# EAGLE design WSS-Board (EAGLE 9.6.2)
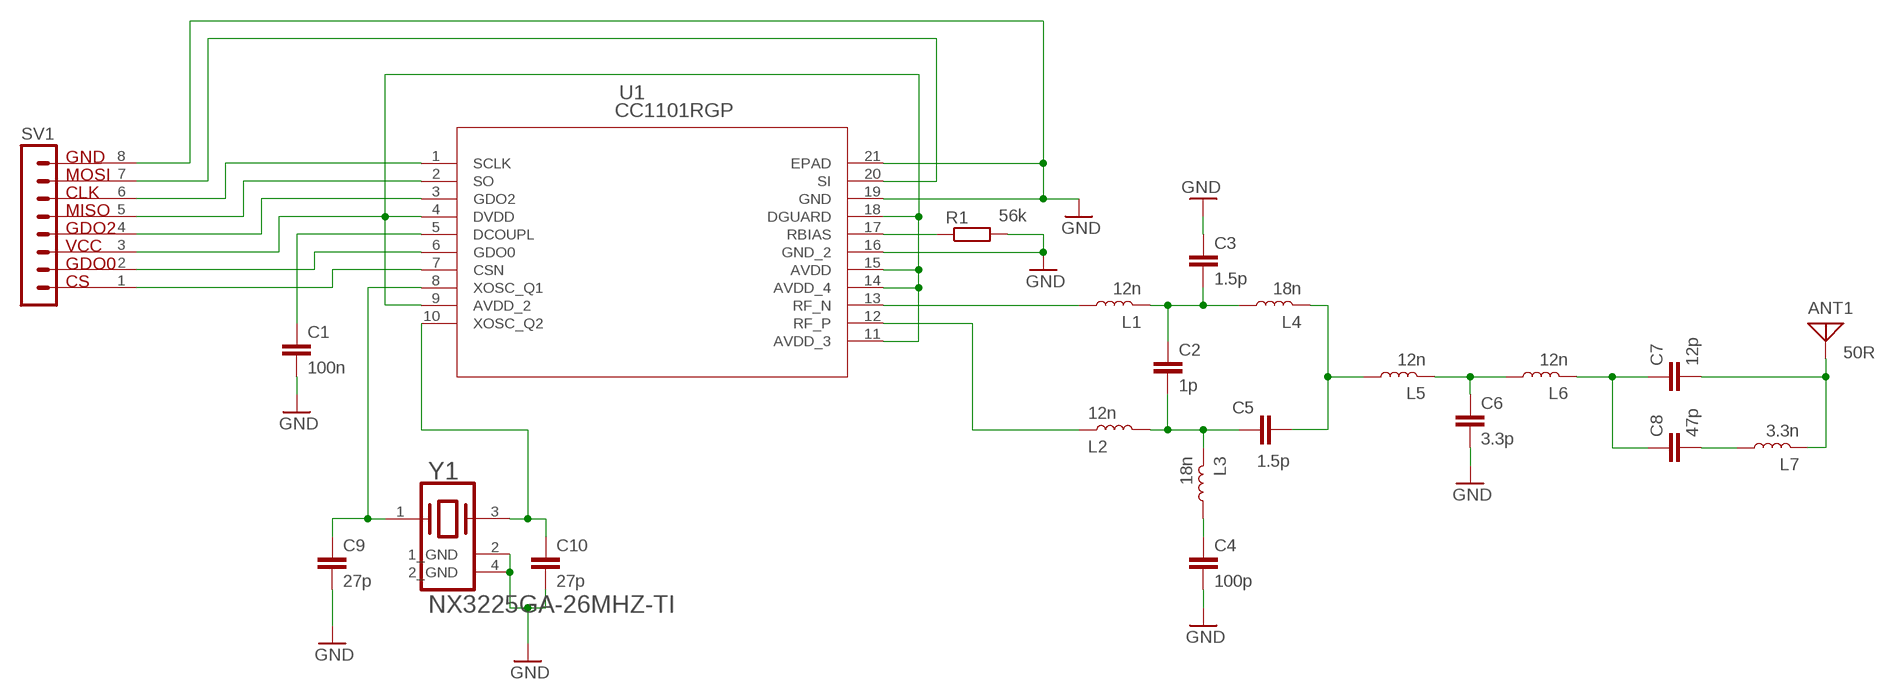
[diagram p0: schematic, sheet 1]

## Parts
ANT1  50R  ANTENNA  [PAD-01]
C1  100n  C-EUC0603  [C0603]
C2  1p  C-EUC0603  [C0603]
C3  1.5p  C-EUC0603  [C0603]
C4  100p  C-EUC0603  [C0603]
C5  1.5p  C-EUC0603  [C0603]
C6  3.3p  C-EUC0603  [C0603]
C7  12p  C-EUC0603  [C0603]
C8  47p  C-EUC0603  [C0603]
C9  27p  C-EUC0603  [C0603]
C10  27p  C-EUC0603  [C0603]
L1  12n  INDUCTOR-0603-33NH  [0603]
L2  12n  INDUCTOR-0603-33NH  [0603]
L3  18n  INDUCTOR-0603-33NH  [0603]
L4  18n  INDUCTOR-0603-33NH  [0603]
L5  12n  INDUCTOR-0603-33NH  [0603]
L6  12n  INDUCTOR-0603-33NH  [0603]
L7  3.3n  INDUCTOR-0603-33NH  [0603]
R1  56k  R-EU_R0603  [R0603]
SV1  MA08-1  [MA08-1]
U1  CC1101RGP  [RGP20_2P4X2P4]
Y1  NDK_NX3225GA-26MHZ-TINDK_NX3225GA-26MHZ-TI_0_0  [NDK_NX3225GA-26MHZ-TI_0]

## Nets
CLK: SV1.6 U1.1(SCLK)
CS: SV1.1 U1.7(CSN)
GDO0: SV1.2 U1.6(GDO0)
GDO2: SV1.4 U1.3(GDO2)
GND: C1.2 C3.1 C4.2 C6.2 C9.2 C10.2 R1.2 SV1.8 U1.16(GND_2) U1.19(GND) U1.21(EPAD) Y1.2(1_GND) Y1.4(2_GND)
MISO: SV1.5 U1.2(SO)
MOSI: SV1.7 U1.20(SI)
N$1: R1.1 U1.17(RBIAS)
N$2: C1.1 U1.5(DCOUPL)
N$3: L1.1 U1.13(RF_N)
N$4: L2.2 U1.12(RF_P)
N$5: C2.1 C3.2 L1.2 L4.1
N$6: C4.1 L3.1
N$7: C2.2 C5.1 L2.1 L3.2
N$8: C5.2 L4.2 L5.1
N$9: C6.1 L5.2 L6.1
N$10: C7.1 C8.1 L6.2
N$11: C8.2 L7.1
N$12: ANT1.1 C7.2 L7.2
N$13: C10.1 U1.10(XOSC_Q2) Y1.3
N$14: C9.1 U1.8(XOSC_Q1) Y1.1
VCC: SV1.3 U1.4(DVDD) U1.9(AVDD_2) U1.11(AVDD_3) U1.14(AVDD_4) U1.15(AVDD) U1.18(DGUARD)

## Library data of the parts
ANT1 = discrete:ANTENNA: Antenna
C1-C10 = rcl:C-EU: CAPACITOR, European symbol; SPICEPREFIX: C
L1-L7 = SparkFun-Coils:INDUCTOR: Inductors Resist changes in electrical current. Basically a coil of wire. SparkFun Products: SparkFun Load Cell Amplifier - HX711 <https://www.sparkfun.com/products/13879> IOIO-OTG - V2.2 <https://www.sparkfun.com/products/13613>; PROD_ID: NDUC-07874; VALUE: 33nH/±5%/500mA
R1 = rcl:R-EU_: RESISTOR, European symbol; SPICEPREFIX: R
SV1 = OASIS-CC1101-Header:MA08-1: PIN HEADER; OC_FARNELL: unknown; OC_NEWARK: unknown
U1 = CC1101:CC1101RGP; COPYRIGHT: Copyright (C) 2022 Ultra Librarian. All rights reserved.; MANUFACTURER_PART_NUMBER: CC1101RGP; MFR_NAME: Texas Instruments
Y1 = NDK - NX3225GA-26MHZ-TI:NDK_NX3225GA-26MHZ-TI: 26MHz ±20ppm Crystal 10pF 50 Ohms 4-SMD; CENTROID_NOT_SPECIFIED: No; DATASHEET: https://media.digikey.com/pdf/Data%20Sheets/NDK%20PDFs/NX3225GA.pdf; DIGIKEY_DESCRIPTION: CRYS 26MHz ±20ppm Crystal 10pF 50 Ohms 4-SMD, No Lead; DIGIKEY_PART_NUMBER: 644-1160-1-ND; LEAD_FREE: yes; MF: NDK; MPN: NX3225GA-26MHZ-TI; PACKAGE: SMD; PREFIX: Y; ROHS: yes; TEMPERATURE_RANGE_HIGH: +150°C; TEMPERATURE_RANGE_LOW: -40°C

## Board
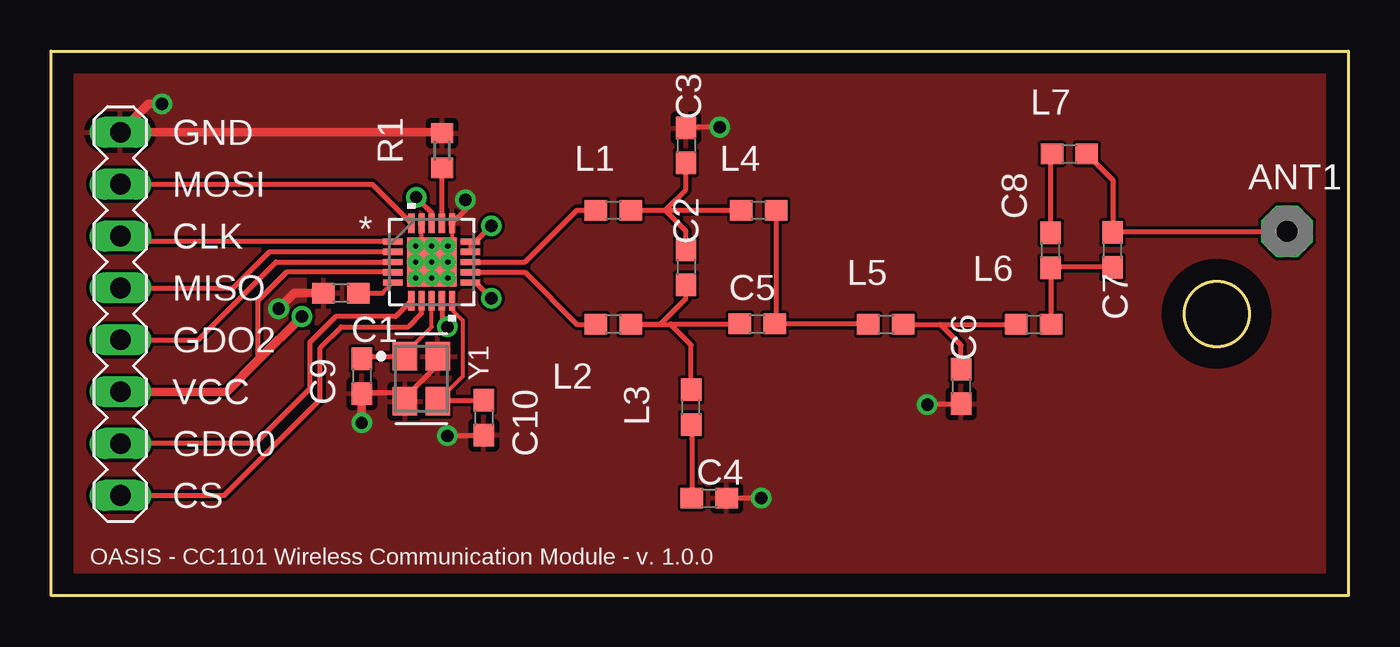
[diagram p1: board, top side]
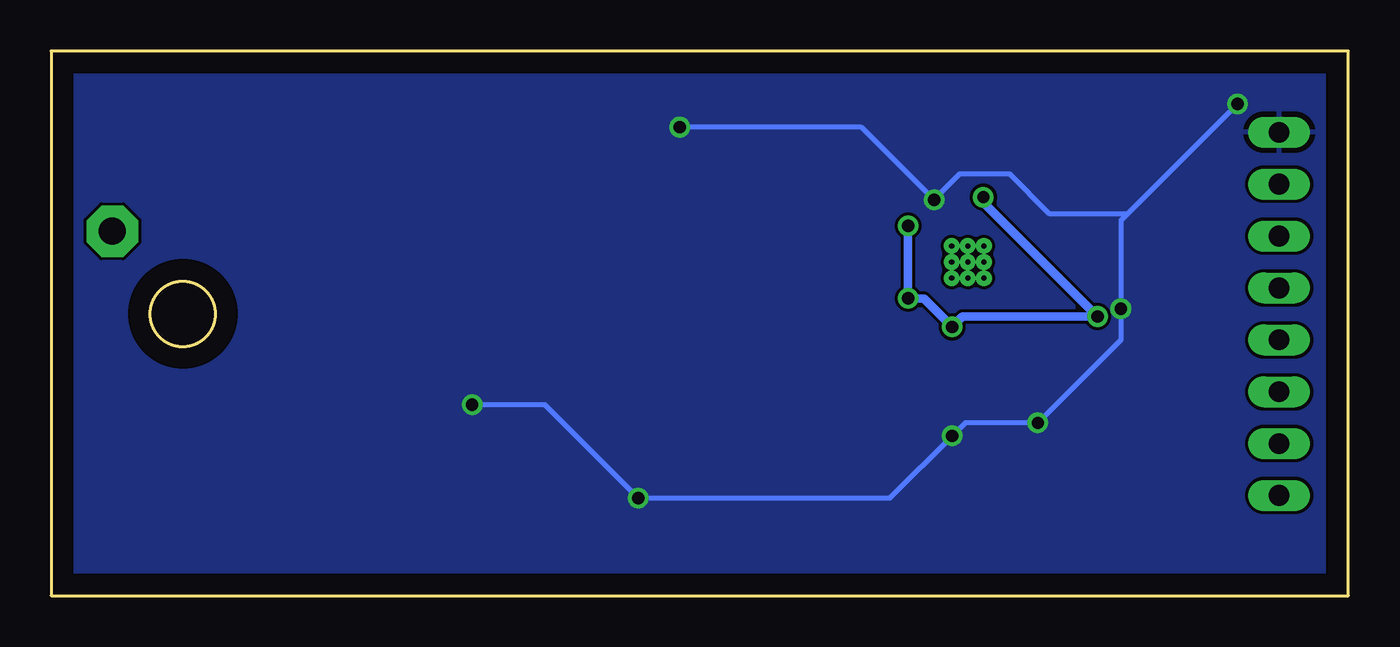
[diagram p2: board, bottom side, seen from below]

Size 63.5 x 26.67 mm. Coordinates in mm from the lower left corner, seen from the top.
Outline: 0,0 63.5,0 63.5,26.67 0,26.67 0,0
Copper layers (1*16): Top 0.035mm / dielectric 1.5mm / Bottom 0.035mm
Design rules "default": minimum track width 6mil, minimum drill 0.35mm, track to track 6mil, track to pad 6mil, pad to pad 6mil, via to via 6mil, smd to smd 6mil, copper to edge 40mil, drill to drill 6mil, minimum pad ring 10mil, minimum via ring 8mil, stop-mask expansion 4mil, vias tented up to drill 0mil, thermal gap 10mil
Holes 3.17 mm at 57.05,13.8

### Footprints (pad centres in the part's own frame; a part is rotated, then mirrored left to right if it is on the bottom)
PAD-01 = drill 1.321 pad 2.54 octagon: 1 0,0
C0603 = smd 1.1 x 1: 1 -0.85,0; 2 0.85,0
0603 = smd 1.1 x 1: 1 -0.85,0; 2 0.85,0
R0603 = smd 1 x 1.1: 1 -0.85,0; 2 0.85,0
MA08-1 = drill 1.016 long: 1 -8.89,0; 2 -6.35,0; 3 -3.81,0; 4 -1.27,0; 5 1.27,0; 6 3.81,0; 7 6.35,0; 8 8.89,0
RGP20_2P4X2P4 = smd 0.953 x 0.305: 1 -1.899,1; 2 -1.899,0.5; 3 -1.899,0; 4 -1.899,-0.5; 5 -1.899,-1; 11 1.899,-1; 12 1.899,-0.5; 13 1.899,0; 14 1.899,0.5; 15 1.899,1 | smd 0.305 x 0.953: 6 -1,-1.899; 7 -0.5,-1.899; 8 0,-1.899; 9 0.5,-1.899; 10 1,-1.899; 16 1,1.899; 17 0.5,1.899; 18 0,1.899; 19 -0.5,1.899; 20 -1,1.899 | smd 2.413 x 2.413: 21 0,0 | drill 0.254 pad 0.508: V -0.787,-0.787; V_1 -0.787,0; V_2 -0.787,0.787; V_3 0,-0.787; V_4 0,0; V_5 0,0.787; V_6 0.787,-0.787; V_7 0.787,0; V_8 0.787,0.787
NDK_NX3225GA-26MHZ-TI_0 = smd 1.4 x 1.2: 1 -1.1,-0.8; 2 1.1,-0.8; 3 1.103,0.8; 4 -1.097,0.8

### Placement (x,y rotation side)
ANT1  60.5,17.84 0 top
C1  14.19,14.81 180 top
C2  31.08,16.08 270 top
C3  31.08,22.05 270 top
C4  32.22,4.78 0 top
C5  34.56,13.31 0 top
C6  44.54,10.24 270 top
C7  51.96,16.94 90 top
C8  48.93,16.92 90 top
C9  15.2,10.75 270 top
C10  21.17,8.72 270 top
L1  27.52,18.88 0 top
L2  27.52,13.29 180 top
L3  31.33,9.23 90 top
L4  34.63,18.88 0 top
L5  40.86,13.29 0 top
L6  48.09,13.29 0 top
L7  49.84,21.63 0 top
R1  19.14,21.8 90 top
SV1  3.39,13.8 90 top
U1  18.63,16.34 0 top
Y1  18.12,10.62 270 top

### Tracks (layer width: path | path; a pad name or v marks a point on that pad's centre or on a via)
CLK
  Top 0.254: U1.1 3.66,17.34 SV1.6
CS
  Top 0.254: SV1.1 8.47,4.91 13.17,9.61 13.17,12.15 14.19,13.16 17.49,13.16 18.13,13.81 U1.7
GDO0
  Top 0.254: U1.6 16.86,13.67 13.93,13.67 12.66,12.4 12.66,10.12 9.99,7.45 SV1.2
GDO2
  Top 0.254: SV1.4 7.2,12.53 11.01,16.34 U1.3
GND  (via drill 0.6)
  Top 0.203: U1.19 18.13,16.84 U1.21 18.63,16.47 19.65,17.48 19.65,18.22 U1.16 | 17.32,9.95 Y1.2
  Top 0.254: C9.2 15.25,9.95 17.32,9.95 | Y1.2 17.32,9.7 18.92,11.3 Y1.4 | C10.2 21.13,7.83 v19.39,7.83 | v20.28,19.39 20.28,18.89 U1.16 | C3.1 31.12,22.94 v32.73,22.94 | C4.2 v34.76,4.78 | v42.89,9.35 42.93,9.39 C6.2
  Top 0.406: R1.2 19.1,22.69 SV1.8 4.79,24.09 v5.42,24.09 | v11.14,14.05 11.9,14.81 C1.2 | C9.2 v15.2,8.46
  Bottom 0.254: v5.42,24.09 10.82,18.69 | 10.82,18.69 11.14,18.37 v11.14,14.05 11.14,12.53 v15.2,8.46 18.76,8.46 v19.39,7.83 22.44,4.78 v34.76,4.78 39.33,9.35 v42.89,9.35 | 10.82,18.69 14.63,18.69 16.6,20.66 19.01,20.66 v20.28,19.39 23.84,22.94 v32.73,22.94
  pour Bottom: -4.55,29.36 63.99,29.36 66.03,27.32 66.03,-3.43 65.61,-3.85 -7.24,-3.85 -4.55,-1.16
  pour Top: -7.28,30.02 73.29,30.02 73.49,29.81 73.49,-4.44 72.81,-5.12 -6.61,-5.12 -7.68,-4.06 -7.68,29.64 -7.3,30.02 -7.28,30
MISO
  Top 0.254: SV1.5 8.91,15.07 10.69,16.85 U1.2
MOSI
  Top 0.254: SV1.7 15.72,20.15 U1.20
N$1
  Top 0.203: R1.1
  Top 0.254: U1.17 R1.1
N$2
  Top 0.203: 16.21,14.81 U1.5
  Top 0.254: C1.1 16.21,14.81
N$3
  Top 0.254: U1.13 23.2,16.34 25.74,18.88 L1.1
N$4
  Top 0.254: U1.12 23.2,15.84 25.74,13.29 L2.2
N$5
  Top 0.254: L1.2 30.06,18.88 | 30.06,18.88 L4.1 | C2.1 31.08,17.86 30.06,18.88 | C3.2 31.08,19.89 30.06,18.88
N$6
  Top 0.254: L3.1 31.37,7.69 C4.1
N$7
  Top 0.254: C2.2 31.08,14.56 29.81,13.29 L2.1 30.32,13.29 | C5.1 30.3,13.31 30.32,13.29 | L3.2 31.33,12.28 30.32,13.29
N$8
  Top 0.152: 35.48,13.38 C5.2
  Top 0.254: L5.1 39.99,13.31 C5.2 | L4.2 35.48,13.38
N$9
  Top 0.254: L5.2 43.52,13.29 | 43.52,13.29 L6.1 | C6.1 44.54,12.28 43.52,13.29
N$10
  Top 0.254: L6.2 48.93,13.31 C8.1 48.95,16.09 C7.1
N$11
  Top 0.254: C8.2 48.93,21.63 L7.1
N$12
  Top 0.254: C7.2 51.98,17.8 | 51.98,17.8 60.46,17.8 ANT1.1 | L7.2 51.98,20.35 51.98,17.8
N$13
  Top 0.203: Y1.3 18.97,9.57 20.15,10.75 20.15,13.48 19.63,14 U1.10
  Top 0.254: 18.97,9.57 C10.1
N$14
  Top 0.203: Y1.1 17.32,11.86 18.63,13.17 U1.8 | C9.1 15.32,11.72
  Top 0.254: 15.32,11.72 Y1.1
VCC  (via drill 0.6)
  Top 0.254: U1.9 19.13,13.43 v19.39,13.16 | U1.11 20.77,15.34 v21.55,14.56 | v21.55,18.12 20.77,17.34 U1.15 U1.14 | U1.4 11.53,15.84 10.12,14.43 10.12,11.51 | U1.18 18.63,18.76 18.4,18.99 18.39,18.99 v17.87,19.51
  Top 0.406: v12.28,13.67 10.12,11.51 8.6,9.99 SV1.3
  Bottom 0.406: v21.55,18.12 v21.55,14.56 20.79,14.56 v19.39,13.16 18.89,13.67 v12.28,13.67 17.87,19.26 v17.87,19.51

### Text on the board
tPlace: OASIS - CC1101 Wireless Communication Module - v. 1.0.0